# Altium project 30A四路继电器控制板.PrjPCB
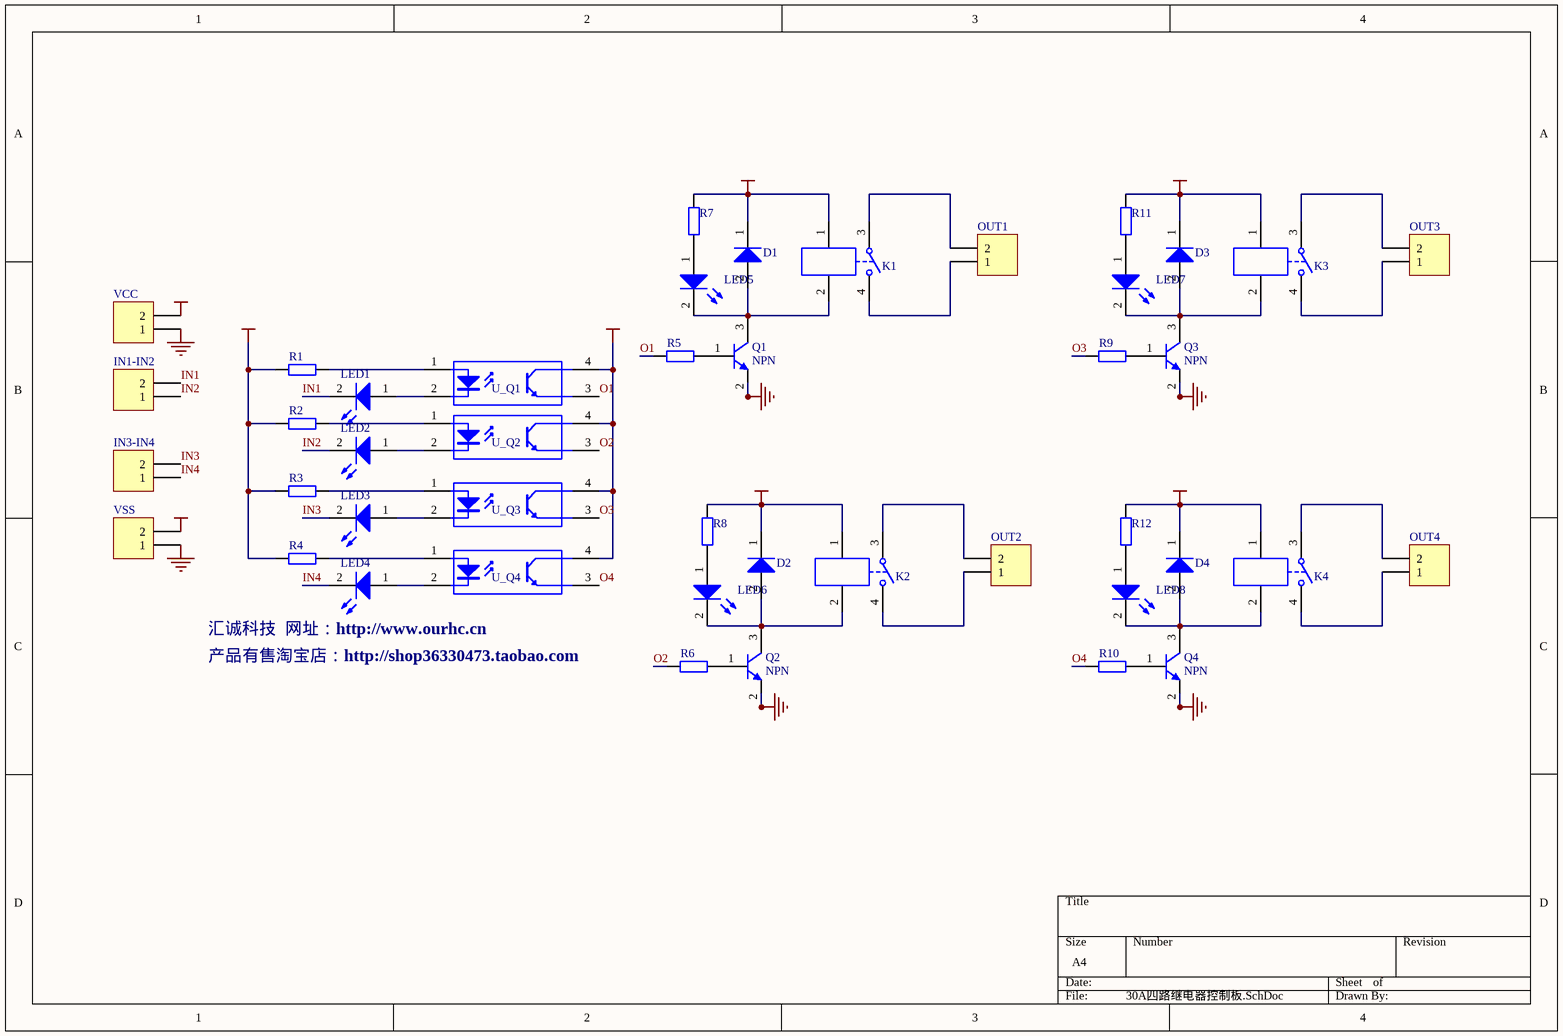
[diagram p0: 30A四路继电器控制板.SchDoc]
1 sheet, 44 parts. Net scope: global (net labels, ports and power ports of the same name join across sheets).
Board file: 30A四路继电器控制板.PcbDoc

## Sheet 30A四路继电器控制板.SchDoc
size A4

### Parts
D1  ZL2JG  [7227]  (value not drawn)
D2  ZL2JG  [7227]  (value not drawn)
D3  ZL2JG  [7227]  (value not drawn)
D4  ZL2JG  [7227]  (value not drawn)
IN1-IN2  PZ_2  [KF8500-2]  (value not drawn)
IN3-IN4  PZ_2  [KF8500-2]  (value not drawn)
K1  JDQ1K  [SLA-12VDC-SL-A]  (value not drawn)
K2  JDQ1K  [SLA-12VDC-SL-A]  (value not drawn)
K3  JDQ1K  [SLA-12VDC-SL-A]  (value not drawn)
K4  JDQ1K  [SLA-12VDC-SL-A]  (value not drawn)
LED1  (no value)  [LED_D]
LED2  (no value)  [LED_D]
LED3  (no value)  [LED_D]
LED4  (no value)  [LED_D]
LED5  (no value)  [LED_D]
LED6  (no value)  [LED_D]
LED7  (no value)  [LED_D]
LED8  (no value)  [LED_D]
OUT1  PZ_2  [KF8500-2]  (value not drawn)
OUT2  PZ_2  [KF8500-2]  (value not drawn)
OUT3  PZ_2  [KF8500-2]  (value not drawn)
OUT4  PZ_2  [KF8500-2]  (value not drawn)
Q1  NPN  [SO-G3]
Q2  NPN  [SO-G3]
Q3  NPN  [SO-G3]
Q4  NPN  [SO-G3]
R1  Res  [TP-0805-R]  (value not drawn)
R2  Res  [TP-0805-R]  (value not drawn)
R3  Res  [TP-0805-R]  (value not drawn)
R4  Res  [TP-0805-R]  (value not drawn)
R5  Res  [TP-0805-R]  (value not drawn)
R6  Res  [TP-0805-R]  (value not drawn)
R7  Res  [TP-0805-R]  (value not drawn)
R8  Res  [TP-0805-R]  (value not drawn)
R9  Res  [TP-0805-R]  (value not drawn)
R10  Res  [TP-0805-R]  (value not drawn)
R11  Res  [TP-0805-R]  (value not drawn)
R12  Res  [TP-0805-R]  (value not drawn)
U_Q1  GO  [DIP-4]  (value not drawn)
U_Q2  GO  [DIP-4]  (value not drawn)
U_Q3  GO  [DIP-4]  (value not drawn)
U_Q4  GO  [DIP-4]  (value not drawn)
VCC  PZ_2  [KF8500-2]  (value not drawn)
VSS  PZ_2  [KF8500-2]  (value not drawn)

### Nets
GND: Q1.2(E) Q2.2(E) Q3.2(E) Q4.2(E) VSS.1
INGND: VCC.1
VCC: R1.2 R2.2 R3.2 R4.2 VCC.2
VSS: D1.1(K) D2.1(K) D3.1(K) D4.1(K) K1.1 K2.1 K3.1 K4.1 R7.2 R8.2 R11.2 R12.2 U_Q1.4(C) U_Q2.4(C) U_Q3.4(C) U_Q4.4(C) VSS.2
IN1: IN1-IN2.2 LED1.2(K)
IN2: IN1-IN2.1 LED2.2(K)
IN3: IN3-IN4.2 LED3.2(K)
IN4: IN3-IN4.1 LED4.2(K)
O1: R5.2 U_Q1.3(E)
O2: R6.2 U_Q2.3(E)
O3: R9.2 U_Q3.3(E)
O4: R10.2 U_Q4.3(E)
NetD1_2: D1.2(A) K1.2 LED5.2(K) Q1.3(C)
NetD2_2: D2.2(A) K2.2 LED6.2(K) Q2.3(C)
NetD3_2: D3.2(A) K3.2 LED7.2(K) Q3.3(C)
NetD4_2: D4.2(A) K4.2 LED8.2(K) Q4.3(C)
NetK1_3: K1.3 OUT1.2
NetK1_4: K1.4 OUT1.1
NetK2_3: K2.3 OUT2.2
NetK2_4: K2.4 OUT2.1
NetK3_3: K3.3 OUT3.2
NetK3_4: K3.4 OUT3.1
NetK4_3: K4.3 OUT4.2
NetK4_4: K4.4 OUT4.1
NetLED1_1: LED1.1(A) U_Q1.2(K)
NetLED2_1: LED2.1(A) U_Q2.2(K)
NetLED3_1: LED3.1(A) U_Q3.2(K)
NetLED4_1: LED4.1(A) U_Q4.2(K)
NetLED5_1: LED5.1(A) R7.1
NetLED6_1: LED6.1(A) R8.1
NetLED7_1: LED7.1(A) R11.1
NetLED8_1: LED8.1(A) R12.1
NetQ1_1: Q1.1(B) R5.1
NetQ2_1: Q2.1(B) R6.1
NetQ3_1: Q3.1(B) R9.1
NetQ4_1: Q4.1(B) R10.1
NetR1_1: R1.1 U_Q1.1(A)
NetR2_1: R2.1 U_Q2.1(A)
NetR3_1: R3.1 U_Q3.1(A)
NetR4_1: R4.1 U_Q4.1(A)

### Notes on the sheet
- 汇诚科技  网址：http://www.ourhc.cn
- 产品有售淘宝店：http://shop36330473.taobao.com

### Library data of the parts
D1-D4 = ZL2JG: 整流二极管; Published: 8-Jun-2000; LatestRevisionDate: 17-Jul-2002; LatestRevisionNote: Re-released for DXP Platform.; DatasheetDocument: 1998; PackageDocument: Aug-1999; PackageReference: DO-201AD; Publisher: Altium Limited
IN1-IN2 IN3-IN4 OUT1-OUT4 VCC VSS = PZ_2: 排针——2; LatestRevisionDate: 17-Jul-2002; LatestRevisionNote: Re-released for DXP Platform.; Publisher: Altium Limited
K1-K4 = JDQ1K: 继电器一常开
LED1-LED8 = LED: 发光二极管; Published: 8-Jun-2000; LatestRevisionDate: 17-Jul-2002; LatestRevisionNote: Re-released for DXP Platform.; Publisher: Altium Limited
Q1-Q4 = NPN: NPN Bipolar Transistor; Published: 8-Jun-2000; LatestRevisionDate: 17-Jul-2002; LatestRevisionNote: Re-released for DXP Platform.; Publisher: Altium Limited; Code_JEDEC: TO-226-AA
R1-R12 = Res: 电阻; Value: 1K; Published: 8-Jun-2000; LatestRevisionDate: 17-Jul-2002; LatestRevisionNote: Re-released for DXP Platform.; Publisher: Altium Limited
U_Q1-U_Q4 = GO: 光耦; Published: 24-Mar-1999; LatestRevisionDate: 17-Jul-2002; LatestRevisionNote: Re-released for DXP Platform.; Publisher: Altium Limited